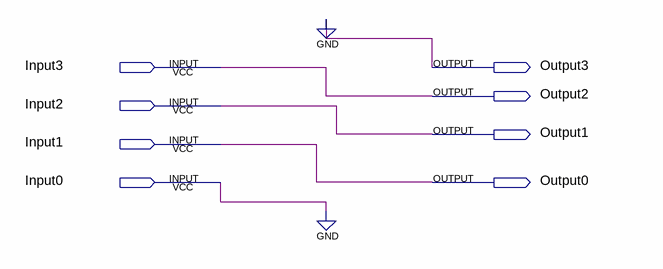
[diagram p0: schematic sheet]
// Quartus schematic Divide2.bdf as structural Verilog: 0 symbols, 8 pins
module Divide2 (
  input  Input3,
  input  Input2,
  input  Input1,
  input  Input0,
  output Output3,
  output Output2,
  output Output1,
  output Output0
);


  assign Output0 = Input1;
  assign Output1 = Input2;
  assign Output2 = Input3;
  assign Output3 = 1'b0;
  // also tied to GND on the sheet: Input0
endmodule
